# Altium project HP_Power_Cal.PrjPcb
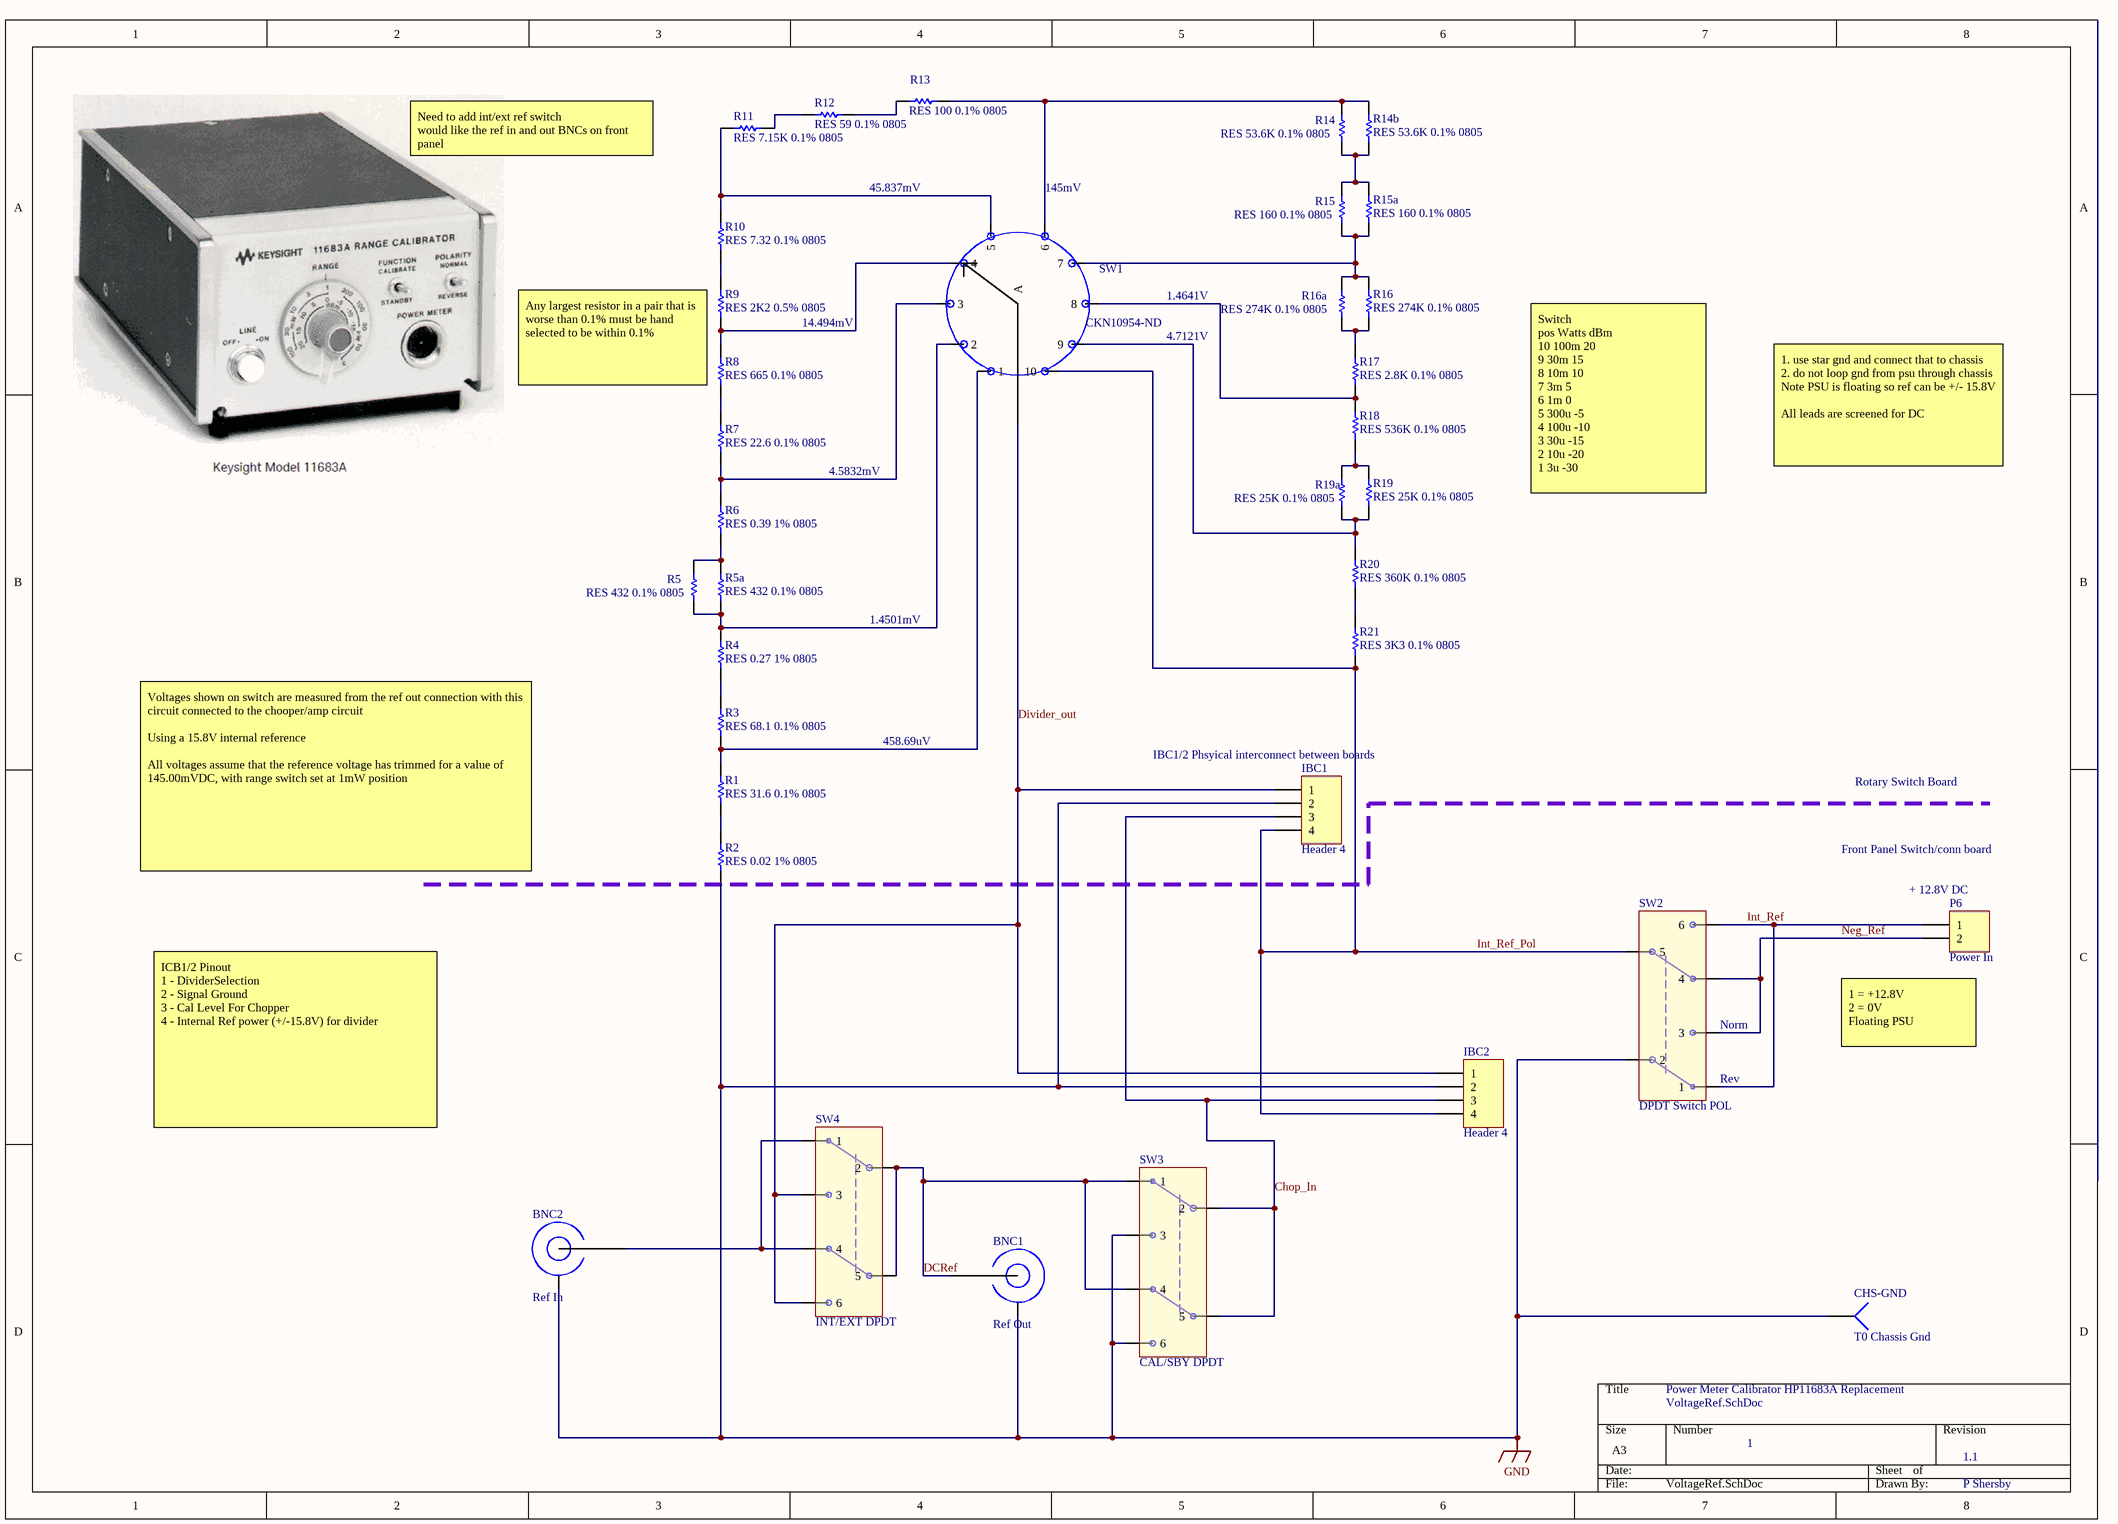
[diagram p0: VoltageRef.SchDoc]
Name: Power Meter Calibrator HP11683A Replacement
3 sheets, 82 parts. Net scope: global (net labels, ports and power ports of the same name join across sheets).
Sheets:
  VoltageRef.SchDoc
  ChopperAmp.SchDoc
  PSU.SchDoc

## Sheet VoltageRef.SchDoc
size A3; Author: P Shersby; SheetNumber: 1

### Parts
BNC1  Ref Out  [BNC PCB Plastic]
BNC2  Ref In  [BNC PCB Plastic]
CHS-GND  T0 Chassis Gnd  [PIN1]
IBC1  Header 4  [HDR1X4]
IBC2  Header 4  [HDR1X4]
P6  Power In  [HDR1X2]
R1  RES 31.6 0.1% 0805  [RESC2013X70X40LL20T20]
R2  RES 0.02 1% 0805  [RESC2013X70X40LL20T20]
R3  RES 68.1 0.1% 0805  [RESC2013X70X40LL20T20]
R4  RES 0.27 1% 0805  [RESC2013X70X40LL20T20]
R5  RES 432 0.1% 0805  [RESC2013X70X40LL20T20]
R5a  RES 432 0.1% 0805  [RESC2013X70X40LL20T20]
R6  RES 0.39 1% 0805  [RESC2013X70X40LL20T20]
R7  RES 22.6 0.1% 0805  [RESC2013X70X40LL20T20]
R8  RES 665 0.1% 0805  [RESC2013X70X40LL20T20]
R9  RES 2K2 0.5% 0805  [RESC2013X70X40LL20T20]
R10  RES 7.32 0.1% 0805  [RESC2013X70X40LL20T20]
R11  RES 7.15K 0.1% 0805  [RESC2013X70X40LL20T20]
R12  RES 59 0.1% 0805  [RESC2013X70X40LL20T20]
R13  RES 100 0.1% 0805  [RESC2013X70X40LL20T20]
R14  RES 53.6K 0.1% 0805  [RESC2013X70X40LL20T20]
R14b  RES 53.6K 0.1% 0805  [RESC2013X70X40LL20T20]
R15  RES 160 0.1% 0805  [RESC2013X70X40LL20T20]
R15a  RES 160 0.1% 0805  [RESC2013X70X40LL20T20]
R16  RES 274K 0.1% 0805  [RESC2013X70X40LL20T20]
R16a  RES 274K 0.1% 0805  [RESC2013X70X40LL20T20]
R17  RES 2.8K 0.1% 0805  [RESC2013X70X40LL20T20]
R18  RES 536K 0.1% 0805  [RESC2013X70X40LL20T20]
R19  RES 25K 0.1% 0805  [RESC2013X70X40LL20T20]
R19a  RES 25K 0.1% 0805  [RESC2013X70X40LL20T20]
R20  RES 360K 0.1% 0805  [RESC2013X70X40LL20T20]
R21  RES 3K3 0.1% 0805  [RESC2013X70X40LL20T20]
SW1  Part Number: CKN10954-ND  [SW_ROT_4x12]  (hidden comment: Rotary Switch 10way)
SW2  DPDT Switch POL  [DPDT Toggle E switch]
SW3  CAL/SBY DPDT  [DPDT Toggle E switch]
SW4  INT/EXT DPDT  [DPDT Toggle E switch]

### Nets
GND: BNC1.2(Gnd) BNC2.2(Gnd) CHS-GND.1 IBC1.2 IBC2.2 R2.1 SW2.2 SW3.3 SW3.6
Chop_In: IBC1.3 IBC2.3 SW3.2 SW3.5
DCRef: BNC1.1(Signal) SW3.1 SW3.4 SW4.2 SW4.5
Divider_out: IBC1.1 IBC2.1 SW1.A SW4.3 SW4.6
Int_Ref: P6.1 SW2.1 SW2.6
Int_Ref_Pol: IBC1.4 IBC2.4 R21.1 SW1.10 SW2.5
Neg_Ref: P6.2 SW2.3 SW2.4
NetBNC2_1: BNC2.1(Signal) SW4.1 SW4.4
NetR1_1: R1.1 R2.2
NetR1_2: R1.2 R3.1 SW1.1
NetR3_2: R3.2 R4.1
NetR4_2: R4.2 R5.1 R5a.1 SW1.2
NetR5_2: R5.2 R5a.2 R6.1
NetR6_2: R6.2 R7.1 SW1.3
NetR7_2: R7.2 R8.1
NetR8_2: R8.2 R9.1 SW1.4
NetR9_2: R9.2 R10.1
NetR10_2: R10.2 R11.1 SW1.5
NetR11_2: R11.2 R12.1
NetR12_2: R12.2 R13.1
NetR13_2: R13.2 R14.2 R14b.2 SW1.6
NetR14_1: R14.1 R14b.1 R15.2 R15a.2
NetR15_1: R15.1 R15a.1 R16.2 R16a.2 SW1.7
NetR16_1: R16.1 R16a.1 R17.2
NetR17_1: R17.1 R18.2 SW1.8
NetR18_1: R18.1 R19.2 R19a.2
NetR19_1: R19.1 R19a.1 R20.2 SW1.9
NetR20_1: R20.1 R21.2

### Notes on the sheet
- Need to add int/ext ref switch
  would like the ref in and out BNCs on front panel
- 45.837mV
- (near SW1) 145mV
- 14.494mV
- 1.4641V
- Any largest resistor in a pair that is worse than 0.1% must be hand selected to be within 0.1%
- 4.7121V
- 1. use star gnd and connect that to chassis
  2. do not loop gnd from psu through chassis
  Note PSU is floating so ref can be +/- 15.8V
  All leads are screened for DC
- 4.5832mV
- Switch
  pos	Watts	dBm
  10	100m	20
  9	30m	15
  8	10m	10
  7	3m	5
  6	1m	0
  5	300u	-5
  4	100u	-10
  3	30u	-15
  2	10u	-20
  1	3u	-30
- 1.4501mV
- 458.69uV
- (near IBC1) IBC1/2 Phsyical interconnect between boards
- Rotary Switch Board
- Voltages shown on switch are measured from the ref out connection with this circuit connected to the chooper/amp circuit
  Using a 15.8V internal reference
  All voltages assume that the reference voltage has trimmed for a value of 145.00mVDC, with range switch set at 1mW position
- Front Panel Switch/conn board
- (near P6) + 12.8V DC
- (near SW2) Norm
- (near P6) 1 = +12.8V
  2 = 0V
  Floating PSU
- ICB1/2 Pinout
  1 - DividerSelection
  2 - Signal Ground
  3 - Cal Level For Chopper
  4 - Internal Ref power (+/-15.8V) for divider
- (near SW2) Rev
- 1.1

### Library data of the parts
BNC1 = BNC PCB: BNC PCB Mount
BNC2 = BNC PCB: BNC Ref Out
CHS-GND = Socket: LatestRevisionDate: 17-Jul-2002; LatestRevisionNote: Re-released for DXP Platform.; Publisher: Altium Limited
IBC1 IBC2 = Header 4: Header, 4-Pin; LatestRevisionDate: 17-Jul-2002; LatestRevisionNote: Re-released for DXP Platform.; Publisher: Altium Limited
P6 = Header 2: Header, 2-Pin; LatestRevisionDate: 17-Jul-2002; LatestRevisionNote: Re-released for DXP Platform.; Publisher: Altium Limited
R1 = CMP-2001-00110-5: Resistor 31.6 0.1% 0805  0.2W 10ppm/C; Manufacturer: Panasonic; Voltage Rating: 150 V; Package Quantity: 5000; PackageDescription: 2-Pin Surface Mount Device, Body 2 x 1.25 mm; Mounting Technology: Surface Mount; ComponentLink2URL: http://industrial.panasonic.com/cdbs/www-data/pdf/RDA0000/AOA0000C86.pdf; DatasheetVersion: 04/2015; ComponentLink1URL: http://www.panasonic.com/; Mount: Surface Mount; ComponentLink1Description: Manufacturer URL; RoHSCompliant: true; PackageReference: 0805; Min Operating Temperature: -55 degC; Height: 0.6 mm; ComponentLink2Description: Datasheet; Max Operating Temperature: 155 degC; Length: 2 mm; Packaging: Tape and Reel; REACH SVHC: Yes
R2 = CMP-2001-00110-5: Resistor 0.02 1% 0805  0.5W 50ppm/C; Manufacturer: Panasonic; Voltage Rating: 150 V; Package Quantity: 5000; PackageDescription: 2-Pin Surface Mount Device, Body 2 x 1.25 mm; Mounting Technology: Surface Mount; ComponentLink2URL: http://industrial.panasonic.com/cdbs/www-data/pdf/RDA0000/AOA0000C86.pdf; DatasheetVersion: 04/2015; ComponentLink1URL: http://www.panasonic.com/; Mount: Surface Mount; ComponentLink1Description: Manufacturer URL; RoHSCompliant: true; PackageReference: 0805; Min Operating Temperature: -55 degC; Height: 0.6 mm; ComponentLink2Description: Datasheet; Max Operating Temperature: 155 degC; Length: 2 mm; Packaging: Tape and Reel; REACH SVHC: Yes
R3 = CMP-2001-00110-5: Resistor 68.1 0.1% 0805  0.2W 10ppm/C; Manufacturer: Panasonic; Voltage Rating: 150 V; Package Quantity: 5000; PackageDescription: 2-Pin Surface Mount Device, Body 2 x 1.25 mm; Mounting Technology: Surface Mount; ComponentLink2URL: http://industrial.panasonic.com/cdbs/www-data/pdf/RDA0000/AOA0000C86.pdf; DatasheetVersion: 04/2015; ComponentLink1URL: http://www.panasonic.com/; Mount: Surface Mount; ComponentLink1Description: Manufacturer URL; RoHSCompliant: true; PackageReference: 0805; Min Operating Temperature: -55 degC; Height: 0.6 mm; ComponentLink2Description: Datasheet; Max Operating Temperature: 155 degC; Length: 2 mm; Packaging: Tape and Reel; REACH SVHC: Yes
R4 = CMP-2001-00110-5: Resistor 0.27 1% 0805  0.2W 10ppm/C; Manufacturer: Panasonic; Voltage Rating: 150 V; Package Quantity: 5000; PackageDescription: 2-Pin Surface Mount Device, Body 2 x 1.25 mm; Mounting Technology: Surface Mount; ComponentLink2URL: http://industrial.panasonic.com/cdbs/www-data/pdf/RDA0000/AOA0000C86.pdf; DatasheetVersion: 04/2015; ComponentLink1URL: http://www.panasonic.com/; Mount: Surface Mount; ComponentLink1Description: Manufacturer URL; RoHSCompliant: true; PackageReference: 0805; Min Operating Temperature: -55 degC; Height: 0.6 mm; ComponentLink2Description: Datasheet; Max Operating Temperature: 155 degC; Length: 2 mm; Packaging: Tape and Reel; REACH SVHC: Yes
R5 R5a = CMP-2001-00110-5: Resistor 432 0.1% 0805  0.2W 10ppm/C; Manufacturer: Panasonic; Voltage Rating: 150 V; Package Quantity: 5000; PackageDescription: 2-Pin Surface Mount Device, Body 2 x 1.25 mm; Mounting Technology: Surface Mount; ComponentLink2URL: http://industrial.panasonic.com/cdbs/www-data/pdf/RDA0000/AOA0000C86.pdf; DatasheetVersion: 04/2015; ComponentLink1URL: http://www.panasonic.com/; Mount: Surface Mount; ComponentLink1Description: Manufacturer URL; RoHSCompliant: true; PackageReference: 0805; Min Operating Temperature: -55 degC; Height: 0.6 mm; ComponentLink2Description: Datasheet; Max Operating Temperature: 155 degC; Length: 2 mm; Packaging: Tape and Reel; REACH SVHC: Yes
R6 = CMP-2001-00110-5: Resistor 0.39 1% 0805  0.2W 10ppm/C; Manufacturer: Panasonic; Voltage Rating: 150 V; Package Quantity: 5000; PackageDescription: 2-Pin Surface Mount Device, Body 2 x 1.25 mm; Mounting Technology: Surface Mount; ComponentLink2URL: http://industrial.panasonic.com/cdbs/www-data/pdf/RDA0000/AOA0000C86.pdf; DatasheetVersion: 04/2015; ComponentLink1URL: http://www.panasonic.com/; Mount: Surface Mount; ComponentLink1Description: Manufacturer URL; RoHSCompliant: true; PackageReference: 0805; Min Operating Temperature: -55 degC; Height: 0.6 mm; ComponentLink2Description: Datasheet; Max Operating Temperature: 155 degC; Length: 2 mm; Packaging: Tape and Reel; REACH SVHC: Yes
R7 = CMP-2001-00110-5: Resistor 22.6 0.1% 0805  0.2W 10ppm/C; Manufacturer: Panasonic; Voltage Rating: 150 V; Package Quantity: 5000; PackageDescription: 2-Pin Surface Mount Device, Body 2 x 1.25 mm; Mounting Technology: Surface Mount; ComponentLink2URL: http://industrial.panasonic.com/cdbs/www-data/pdf/RDA0000/AOA0000C86.pdf; DatasheetVersion: 04/2015; ComponentLink1URL: http://www.panasonic.com/; Mount: Surface Mount; ComponentLink1Description: Manufacturer URL; RoHSCompliant: true; PackageReference: 0805; Min Operating Temperature: -55 degC; Height: 0.6 mm; ComponentLink2Description: Datasheet; Max Operating Temperature: 155 degC; Length: 2 mm; Packaging: Tape and Reel; REACH SVHC: Yes
R8 = CMP-2001-00110-5: Resistor 665 0.1% 0805  0.2W 10ppm/C; Manufacturer: Panasonic; Voltage Rating: 150 V; Package Quantity: 5000; PackageDescription: 2-Pin Surface Mount Device, Body 2 x 1.25 mm; Mounting Technology: Surface Mount; ComponentLink2URL: http://industrial.panasonic.com/cdbs/www-data/pdf/RDA0000/AOA0000C86.pdf; DatasheetVersion: 04/2015; ComponentLink1URL: http://www.panasonic.com/; Mount: Surface Mount; ComponentLink1Description: Manufacturer URL; RoHSCompliant: true; PackageReference: 0805; Min Operating Temperature: -55 degC; Height: 0.6 mm; ComponentLink2Description: Datasheet; Max Operating Temperature: 155 degC; Length: 2 mm; Packaging: Tape and Reel; REACH SVHC: Yes
R9 = CMP-2001-00110-5: Resistor 2K2 0.5%  0805  0.2W 10ppm/C; Manufacturer: Panasonic; Voltage Rating: 150 V; Package Quantity: 5000; PackageDescription: 2-Pin Surface Mount Device, Body 2 x 1.25 mm; Mounting Technology: Surface Mount; ComponentLink2URL: http://industrial.panasonic.com/cdbs/www-data/pdf/RDA0000/AOA0000C86.pdf; DatasheetVersion: 04/2015; ComponentLink1URL: http://www.panasonic.com/; Mount: Surface Mount; ComponentLink1Description: Manufacturer URL; RoHSCompliant: true; PackageReference: 0805; Min Operating Temperature: -55 degC; Height: 0.6 mm; ComponentLink2Description: Datasheet; Max Operating Temperature: 155 degC; Length: 2 mm; Packaging: Tape and Reel; REACH SVHC: Yes
R10 = CMP-2001-00110-5: Resistor 7.32 0.1% 0805  0.2W 10ppm/C; Manufacturer: Panasonic; Voltage Rating: 150 V; Package Quantity: 5000; PackageDescription: 2-Pin Surface Mount Device, Body 2 x 1.25 mm; Mounting Technology: Surface Mount; ComponentLink2URL: http://industrial.panasonic.com/cdbs/www-data/pdf/RDA0000/AOA0000C86.pdf; DatasheetVersion: 04/2015; ComponentLink1URL: http://www.panasonic.com/; Mount: Surface Mount; ComponentLink1Description: Manufacturer URL; RoHSCompliant: true; PackageReference: 0805; Min Operating Temperature: -55 degC; Height: 0.6 mm; ComponentLink2Description: Datasheet; Max Operating Temperature: 155 degC; Length: 2 mm; Packaging: Tape and Reel; REACH SVHC: Yes
R11 = CMP-2001-00110-5: Resistor 7.15K 0.1% 0805  0.2W 10ppm/C; Manufacturer: Panasonic; Voltage Rating: 150 V; Package Quantity: 5000; PackageDescription: 2-Pin Surface Mount Device, Body 2 x 1.25 mm; Mounting Technology: Surface Mount; ComponentLink2URL: http://industrial.panasonic.com/cdbs/www-data/pdf/RDA0000/AOA0000C86.pdf; DatasheetVersion: 04/2015; ComponentLink1URL: http://www.panasonic.com/; Mount: Surface Mount; ComponentLink1Description: Manufacturer URL; RoHSCompliant: true; PackageReference: 0805; Min Operating Temperature: -55 degC; Height: 0.6 mm; ComponentLink2Description: Datasheet; Max Operating Temperature: 155 degC; Length: 2 mm; Packaging: Tape and Reel; REACH SVHC: Yes
R12 = CMP-2001-00110-5: Resistor 59 0.1% 0805  0.2W 10ppm/C; Manufacturer: Panasonic; Voltage Rating: 150 V; Package Quantity: 5000; PackageDescription: 2-Pin Surface Mount Device, Body 2 x 1.25 mm; Mounting Technology: Surface Mount; ComponentLink2URL: http://industrial.panasonic.com/cdbs/www-data/pdf/RDA0000/AOA0000C86.pdf; DatasheetVersion: 04/2015; ComponentLink1URL: http://www.panasonic.com/; Mount: Surface Mount; ComponentLink1Description: Manufacturer URL; RoHSCompliant: true; PackageReference: 0805; Min Operating Temperature: -55 degC; Height: 0.6 mm; ComponentLink2Description: Datasheet; Max Operating Temperature: 155 degC; Length: 2 mm; Packaging: Tape and Reel; REACH SVHC: Yes
R13 = CMP-2001-00110-5: Resistor 100 0.1% 0805  0.2W 10ppm/C; Manufacturer: Panasonic; Voltage Rating: 150 V; Package Quantity: 5000; PackageDescription: 2-Pin Surface Mount Device, Body 2 x 1.25 mm; Mounting Technology: Surface Mount; ComponentLink2URL: http://industrial.panasonic.com/cdbs/www-data/pdf/RDA0000/AOA0000C86.pdf; DatasheetVersion: 04/2015; ComponentLink1URL: http://www.panasonic.com/; Mount: Surface Mount; ComponentLink1Description: Manufacturer URL; RoHSCompliant: true; PackageReference: 0805; Min Operating Temperature: -55 degC; Height: 0.6 mm; ComponentLink2Description: Datasheet; Max Operating Temperature: 155 degC; Length: 2 mm; Packaging: Tape and Reel; REACH SVHC: Yes
R14 R14b = CMP-2001-00110-5: Resistor 53.6K 0.1% 0805  0.2W 10ppm/C; Manufacturer: Panasonic; Voltage Rating: 150 V; Package Quantity: 5000; PackageDescription: 2-Pin Surface Mount Device, Body 2 x 1.25 mm; Mounting Technology: Surface Mount; ComponentLink2URL: http://industrial.panasonic.com/cdbs/www-data/pdf/RDA0000/AOA0000C86.pdf; DatasheetVersion: 04/2015; ComponentLink1URL: http://www.panasonic.com/; Mount: Surface Mount; ComponentLink1Description: Manufacturer URL; RoHSCompliant: true; PackageReference: 0805; Min Operating Temperature: -55 degC; Height: 0.6 mm; ComponentLink2Description: Datasheet; Max Operating Temperature: 155 degC; Length: 2 mm; Packaging: Tape and Reel; REACH SVHC: Yes
R15 R15a = CMP-2001-00110-5: Resistor 160 0.1% 0805  0.2W 10ppm/C; Manufacturer: Panasonic; Voltage Rating: 150 V; Package Quantity: 5000; PackageDescription: 2-Pin Surface Mount Device, Body 2 x 1.25 mm; Mounting Technology: Surface Mount; ComponentLink2URL: http://industrial.panasonic.com/cdbs/www-data/pdf/RDA0000/AOA0000C86.pdf; DatasheetVersion: 04/2015; ComponentLink1URL: http://www.panasonic.com/; Mount: Surface Mount; ComponentLink1Description: Manufacturer URL; RoHSCompliant: true; PackageReference: 0805; Min Operating Temperature: -55 degC; Height: 0.6 mm; ComponentLink2Description: Datasheet; Max Operating Temperature: 155 degC; Length: 2 mm; Packaging: Tape and Reel; REACH SVHC: Yes
R16 R16a = CMP-2001-00110-5: Resistor 274K 0.1% 0805  0.2W 10ppm/C; Manufacturer: Panasonic; Voltage Rating: 150 V; Package Quantity: 5000; PackageDescription: 2-Pin Surface Mount Device, Body 2 x 1.25 mm; Mounting Technology: Surface Mount; ComponentLink2URL: http://industrial.panasonic.com/cdbs/www-data/pdf/RDA0000/AOA0000C86.pdf; DatasheetVersion: 04/2015; ComponentLink1URL: http://www.panasonic.com/; Mount: Surface Mount; ComponentLink1Description: Manufacturer URL; RoHSCompliant: true; PackageReference: 0805; Min Operating Temperature: -55 degC; Height: 0.6 mm; ComponentLink2Description: Datasheet; Max Operating Temperature: 155 degC; Length: 2 mm; Packaging: Tape and Reel; REACH SVHC: Yes
R17 = CMP-2001-00110-5: Resistor 2.8K 0.1% 0805  0.2W 10ppm/C; Manufacturer: Panasonic; Voltage Rating: 150 V; Package Quantity: 5000; PackageDescription: 2-Pin Surface Mount Device, Body 2 x 1.25 mm; Mounting Technology: Surface Mount; ComponentLink2URL: http://industrial.panasonic.com/cdbs/www-data/pdf/RDA0000/AOA0000C86.pdf; DatasheetVersion: 04/2015; ComponentLink1URL: http://www.panasonic.com/; Mount: Surface Mount; ComponentLink1Description: Manufacturer URL; RoHSCompliant: true; PackageReference: 0805; Min Operating Temperature: -55 degC; Height: 0.6 mm; ComponentLink2Description: Datasheet; Max Operating Temperature: 155 degC; Length: 2 mm; Packaging: Tape and Reel; REACH SVHC: Yes
R18 = CMP-2001-00110-5: Resistor 536K 0.1% 0805  1/8W 10ppm/C; Manufacturer: Panasonic; Voltage Rating: 150 V; Package Quantity: 5000; PackageDescription: 2-Pin Surface Mount Device, Body 2 x 1.25 mm; Mounting Technology: Surface Mount; ComponentLink2URL: http://industrial.panasonic.com/cdbs/www-data/pdf/RDA0000/AOA0000C86.pdf; DatasheetVersion: 04/2015; ComponentLink1URL: http://www.panasonic.com/; Mount: Surface Mount; ComponentLink1Description: Manufacturer URL; RoHSCompliant: true; PackageReference: 0805; Min Operating Temperature: -55 degC; Height: 0.6 mm; ComponentLink2Description: Datasheet; Max Operating Temperature: 155 degC; Length: 2 mm; Packaging: Tape and Reel; REACH SVHC: Yes
R19 R19a = CMP-2001-00110-5: Resistor 25K 0.1% 0805  0.1W 10ppm/C; Manufacturer: Panasonic; Voltage Rating: 150 V; Package Quantity: 5000; PackageDescription: 2-Pin Surface Mount Device, Body 2 x 1.25 mm; Mounting Technology: Surface Mount; ComponentLink2URL: http://industrial.panasonic.com/cdbs/www-data/pdf/RDA0000/AOA0000C86.pdf; DatasheetVersion: 04/2015; ComponentLink1URL: http://www.panasonic.com/; Mount: Surface Mount; ComponentLink1Description: Manufacturer URL; RoHSCompliant: true; PackageReference: 0805; Min Operating Temperature: -55 degC; Height: 0.6 mm; ComponentLink2Description: Datasheet; Max Operating Temperature: 155 degC; Length: 2 mm; Packaging: Tape and Reel; REACH SVHC: Yes
R20 = CMP-2001-00110-5: Resistor 360K 0.1% 0805  1/8W 10ppm/C; Manufacturer: Panasonic; Voltage Rating: 150 V; Package Quantity: 5000; PackageDescription: 2-Pin Surface Mount Device, Body 2 x 1.25 mm; Mounting Technology: Surface Mount; ComponentLink2URL: http://industrial.panasonic.com/cdbs/www-data/pdf/RDA0000/AOA0000C86.pdf; DatasheetVersion: 04/2015; ComponentLink1URL: http://www.panasonic.com/; Mount: Surface Mount; ComponentLink1Description: Manufacturer URL; RoHSCompliant: true; PackageReference: 0805; Min Operating Temperature: -55 degC; Height: 0.6 mm; ComponentLink2Description: Datasheet; Max Operating Temperature: 155 degC; Length: 2 mm; Packaging: Tape and Reel; REACH SVHC: Yes
R21 = CMP-2001-00110-5: Resistor 3K3 0.1% 0805  0.2W 10ppm/C; Manufacturer: Panasonic; Voltage Rating: 150 V; Package Quantity: 5000; PackageDescription: 2-Pin Surface Mount Device, Body 2 x 1.25 mm; Mounting Technology: Surface Mount; ComponentLink2URL: http://industrial.panasonic.com/cdbs/www-data/pdf/RDA0000/AOA0000C86.pdf; DatasheetVersion: 04/2015; ComponentLink1URL: http://www.panasonic.com/; Mount: Surface Mount; ComponentLink1Description: Manufacturer URL; RoHSCompliant: true; PackageReference: 0805; Min Operating Temperature: -55 degC; Height: 0.6 mm; ComponentLink2Description: Datasheet; Max Operating Temperature: 155 degC; Length: 2 mm; Packaging: Tape and Reel; REACH SVHC: Yes
SW1 = Rotary_Switch_1x10: Rotary Switch 10way PCB CKN10954-ND
SW2 SW4 = DPDT Switch
SW3 = DPDT Switch: CAL/SDBY DPDT

## Sheet ChopperAmp.SchDoc
size A3; Author: P Shersby; SheetNumber: 1; SheetTotal: 1; DocumentName: Sampling Gate Assembly
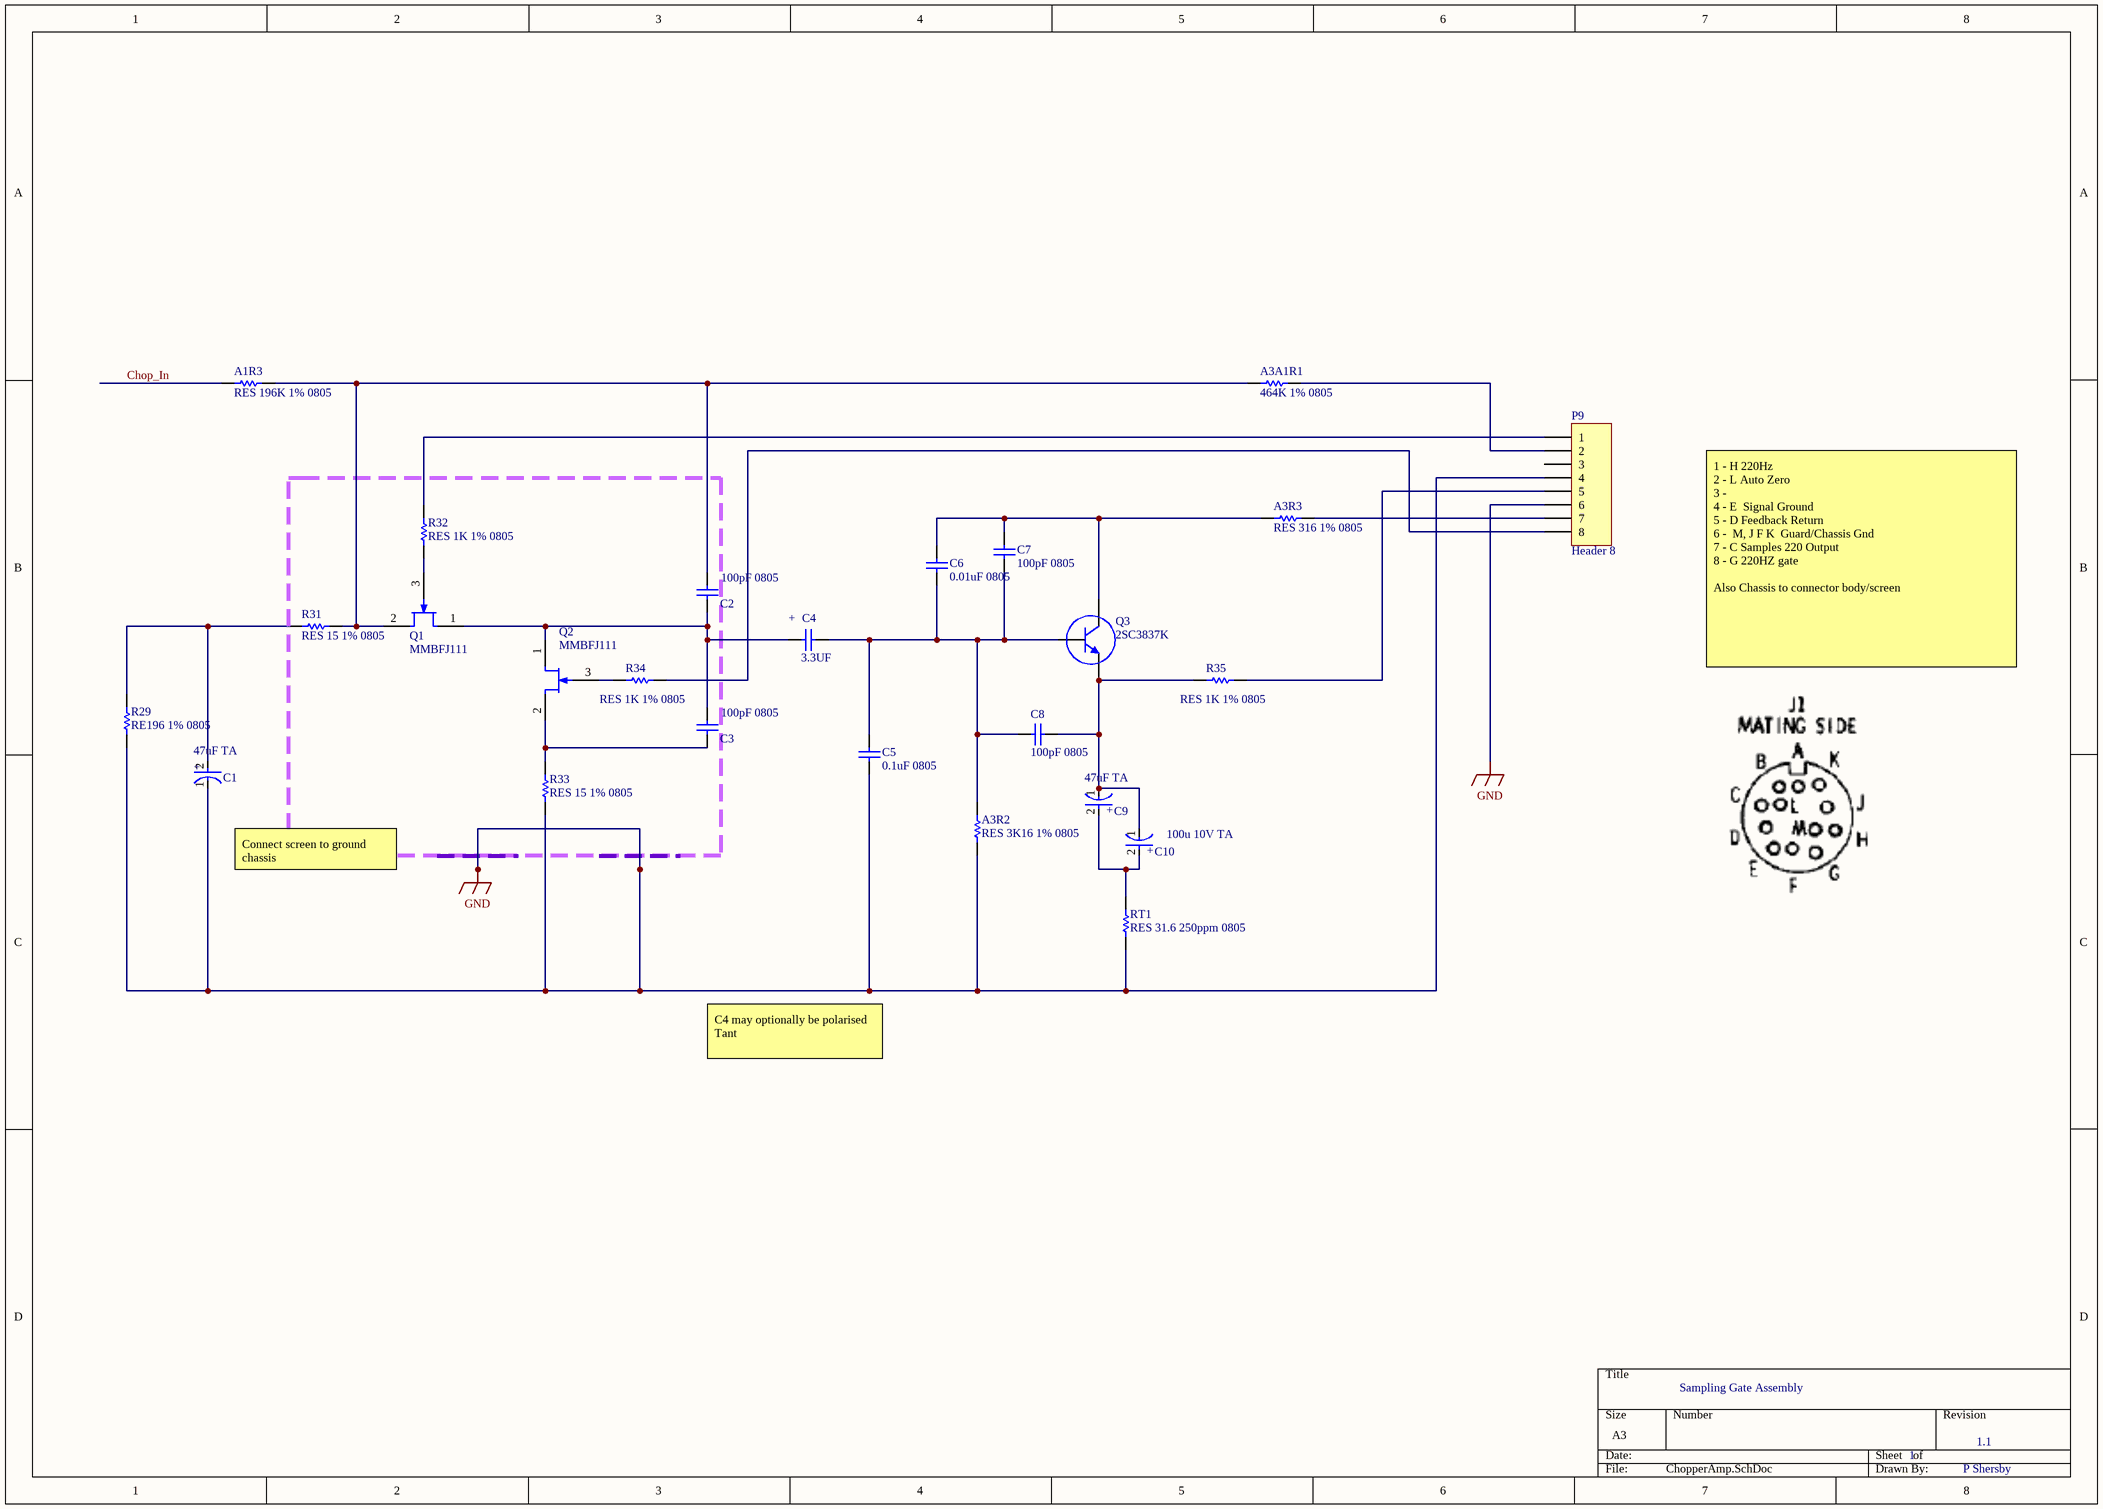
[diagram p1: ChopperAmp.SchDoc]

### Parts
A1R3  RES 196K 1% 0805  [RESC2013X70X40LL20T20]
A3A1R1  464K 1% 0805  [RESC2013X70X40LL20T20]
A3R2  RES 3K16 1% 0805  [RESC2013X70X40LL20T20]
A3R3  RES 316 1% 0805  [RESC2013X70X40LL20T20]
C1  47uF TA  [FP-TAJB-MFG]
C2  100pF 0805  [CAPC2113X88X50NL30T25]
C3  100pF 0805  [CAPC2113X88X50NL30T25]
C4  3.3UF  [CAPC1206(3216)150_L]
C5  0.1uF 0805  [CAPC2113X88X50NL30T25]
C6  0.01uF 0805  [CAPC2113X88X50NL30T25]
C7  100pF 0805  [CAPC2113X88X50NL30T25]
C8  100pF 0805  [CAPC2113X88X50NL30T25]
C9  47uF TA  [FP-TAJB-MFG]
C10  100u 10V TA  [FP-TPE-D4-MFG]
P9  Header 8  [HDR1X8]
Q1  MMBFJ111  [ONSC-SOT-23-3-318-08_V]
Q2  MMBFJ111  [ONSC-SOT-23-3-318-08_V]
Q3  2SC3837K  [SC-59]
R29  RE196 1% 0805  [RESC2013X70X40LL20T20]
R31  RES 15 1% 0805  [RESC2013X70X40LL20T20]
R32  RES 1K 1% 0805  [RESC2013X70X40LL20T20]
R33  RES 15 1% 0805  [RESC2013X70X40LL20T20]
R34  RES 1K 1% 0805  [RESC2013X70X40LL20T20]
R35  RES 1K 1% 0805  [RESC2013X70X40LL20T20]
RT1  RES 31.6 250ppm 0805  [RESC2013X70X40LL20T20]
SC1  ScreenConnection  [ScreenConnection]  (value not drawn)
SC2  ScreenConnection  [ScreenConnection]  (value not drawn)

### Nets
GND: A3R2.1 C1.1(C) C5.2 P9.4 P9.6 R29.2 R33.2 RT1.1 SC1.1 SC2.1
Chop_In: A1R3.1
NetA1R3_2: A1R3.2 A3A1R1.1 C2.2 Q1.2(S) R31.1
NetA3A1R1_2: A3A1R1.2 P9.2
NetA3R2_2: A3R2.2 C4.2 C5.1 C6.2 C7.2 C8.2 Q3.2(B)
NetA3R3_1: A3R3.1 C6.1 C7.1 Q3.1(C)
NetA3R3_2: A3R3.2 P9.7
NetC1_2: C1.2(A) R29.1 R31.2
NetC2_1: C2.1 C3.2 C4.1 Q1.1(D) Q2.1(D)
NetC3_1: C3.1 Q2.2(S) R33.1
NetC8_1: C8.1 C9.1(C) C10.1(C) Q3.3(E) R35.1
NetC9_2: C9.2(A) C10.2(A) RT1.2
NetP9_1: P9.1 R32.1
NetP9_5: P9.5 R35.2
NetP9_8: P9.8 R34.2
NetQ1_3: Q1.3(G) R32.2
NetQ2_3: Q2.3(G) R34.1

Not connected (* = marked no-connect by the designer): P9 3

### Notes on the sheet
- (near C4) +
- 1 - H 220Hz
  2 - L Auto Zero
  3 -
  4 - E  Signal Ground
  5 - D Feedback Return
  6 -  M, J F K  Guard/Chassis Gnd
  7 - C Samples 220 Output
  8 - G 220HZ gate
  Also Chassis to connector body/screen
- Connect screen to ground chassis
- C4 may optionally be polarised Tant
- 1.1
- (in symbol CMP-04424-000035-1) +
- (in symbol CMP-05428-000010-1) +

### Library data of the parts
A1R3 = CMP-2001-00110-5: Resistor 196K 1% 0805  1/8W 10ppm/C; Manufacturer: Panasonic; Voltage Rating: 150 V; Package Quantity: 5000; PackageDescription: 2-Pin Surface Mount Device, Body 2 x 1.25 mm; Mounting Technology: Surface Mount; ComponentLink2URL: http://industrial.panasonic.com/cdbs/www-data/pdf/RDA0000/AOA0000C86.pdf; DatasheetVersion: 04/2015; ComponentLink1URL: http://www.panasonic.com/; Mount: Surface Mount; ComponentLink1Description: Manufacturer URL; RoHSCompliant: true; PackageReference: 0805; Min Operating Temperature: -55 degC; Height: 0.6 mm; ComponentLink2Description: Datasheet; Max Operating Temperature: 155 degC; Length: 2 mm; Packaging: Tape and Reel; REACH SVHC: Yes
A3A1R1 = CMP-2001-00110-5: Resistor 464K 1% 0805   0.2W 10ppm/C; Manufacturer: Panasonic; Voltage Rating: 150 V; Package Quantity: 5000; PackageDescription: 2-Pin Surface Mount Device, Body 2 x 1.25 mm; Mounting Technology: Surface Mount; ComponentLink2URL: http://industrial.panasonic.com/cdbs/www-data/pdf/RDA0000/AOA0000C86.pdf; DatasheetVersion: 04/2015; ComponentLink1URL: http://www.panasonic.com/; Mount: Surface Mount; ComponentLink1Description: Manufacturer URL; RoHSCompliant: true; PackageReference: 0805; Min Operating Temperature: -55 degC; Height: 0.6 mm; ComponentLink2Description: Datasheet; Max Operating Temperature: 155 degC; Length: 2 mm; Packaging: Tape and Reel; REACH SVHC: Yes
A3R2 = CMP-2001-00110-5: Resistor 3K!6 1% 0805  1/8W 10ppm/C; Manufacturer: Panasonic; Voltage Rating: 150 V; Package Quantity: 5000; PackageDescription: 2-Pin Surface Mount Device, Body 2 x 1.25 mm; Mounting Technology: Surface Mount; ComponentLink2URL: http://industrial.panasonic.com/cdbs/www-data/pdf/RDA0000/AOA0000C86.pdf; DatasheetVersion: 04/2015; ComponentLink1URL: http://www.panasonic.com/; Mount: Surface Mount; ComponentLink1Description: Manufacturer URL; RoHSCompliant: true; PackageReference: 0805; Min Operating Temperature: -55 degC; Height: 0.6 mm; ComponentLink2Description: Datasheet; Max Operating Temperature: 155 degC; Length: 2 mm; Packaging: Tape and Reel; REACH SVHC: Yes
A3R3 = CMP-2001-00110-5: Resistor 316 1% 0805  1/8W 10ppm/C; Manufacturer: Panasonic; Voltage Rating: 150 V; Package Quantity: 5000; PackageDescription: 2-Pin Surface Mount Device, Body 2 x 1.25 mm; Mounting Technology: Surface Mount; ComponentLink2URL: http://industrial.panasonic.com/cdbs/www-data/pdf/RDA0000/AOA0000C86.pdf; DatasheetVersion: 04/2015; ComponentLink1URL: http://www.panasonic.com/; Mount: Surface Mount; ComponentLink1Description: Manufacturer URL; RoHSCompliant: true; PackageReference: 0805; Min Operating Temperature: -55 degC; Height: 0.6 mm; ComponentLink2Description: Datasheet; Max Operating Temperature: 155 degC; Length: 2 mm; Packaging: Tape and Reel; REACH SVHC: Yes
C1 C9 = CMP-04424-000035-1: 47uF Tant 4V 1411; Manufacturer: AVX Corporation; Manufacturer Part Number: TAJB475K010RNJ; Life: 1000Hours; Material: Tantalum; Ripple Current: 146mA; Value: 4.7uF; Esr: 4Ω; Voltage Rating: 10V; Dissipation Factor: 6%; Tolerance: 10%; Footprint Url: https://www.avx.com/docs/techinfo/TechSumAppGuide.pdf; Category: Cap; Device Class L1: Passive Components; ComponentLink2URL: http://datasheets.avx.com/TAJ.pdf; Height: 2.1mm; RoHS: TRUE; Automotive: No; Temperature: -55°C to +125°C; Lead Free: Yes; Digikey Description: CAP TANT 4.7UF 10% 10V 1411; Package: TAJB; Device Class L2: Capacitors; Mouser Description: Cap Tant Solid 4.7uF 10V B CASE 10% (3.5 X 2.8 X 1.9mm) SMD 3528-21 4 Ohm 125 C T/R; ComponentLink2Description: Datasheet; Device Class L3: Tantalum Capacitors; Temperature Range High: +125°C; Temperature Range Low: -55°C; Octopart: https://octopart.com/tajb475k010rnj-avx-2636133; Capacitance: 4.7uF
C2 C3 C5-C8 = CMP-2007-00001-1: Manufacturer: Kemet; Part Number: C0805X474K4RACTU
C4 = CMP-1590-00001-1: 1206 (3216 Metric) Chip Capacitor; Case-Metric: 3216; Case-EIA: 1206; PackageReference: CAPC1206(3216)150
C10 = CMP-05428-000010-1: CAP TANT 100u 10V; Manufacturer Part Number: 6TPE330MAA; Manufacturer: Panasonic Electronic; Tolerance: 20%; Value: 330uF; Ripple Current: 4400mA; Voltage Rating: 6.3V; Life: 1000Hours; Leakage Current: 207.9uA; Esr: 10mΩ; Material: Polymer; Dissipation Factor: 10%; Temperature Range High: +105°C; Mouser Description: Tantalum Capacitors - Polymer SMD 6.3volts 330uF ESR 10mohm; Device Class L3: Polymer Capacitors; ComponentLink2URL: https://industrial.panasonic.com/cdbs/www-data/pdf/AAA8000/AAA8000C36.pdf; Digikey Description: CAP TANT POLY 330UF 6.3V 2917; Temperature: -55°C to +105°C; Category: Cap; Package: TPE-D4; Temperature Range Low: -55°C; Footprint Url: https://industrial.panasonic.com/cdbs/www-data/pdf/AAA8000/AAA8000COL85.pdf; Height: 4mm; Octopart: https://octopart.com/6tpe330maa-panasonic-29487875; ComponentLink2Description: Datasheet; Device Class L1: Passive Components; Device Class L2: Capacitors; Lead Free: Yes; RoHS: TRUE; Automotive: No; Capacitance: 330uF
P9 = Header 8: Header, 8-Pin; LatestRevisionDate: 17-Jul-2002; LatestRevisionNote: Re-released for DXP Platform.; Publisher: Altium Limited
Q1 Q2 = CMP-1062-00038-1: JFET - VHF / UJFET Chopper; PartNumber: MMBFJ310LT3; Manufacturer: On Semiconductor; IDSS Min (uA): 24000; Crss Max (pF): 2.5; Ciss Max (pF): 5; Channel Polarity: N Channel; V(BR)GSS Min (V): 25; Packing: Tape and Reel; IDSS Max (uA): 60000; ComponentLink1URL: http://www.onsemi.com/; PackageReference: SOT-23-3-318-08; ComponentLink3URL: http://www.onsemi.cn/pub_link/Collateral/318-08.PDF; PackageDescription: 3-Pin Small Outline Transistor, Body 2.92 x 1.3 mm, Pitch 0.95 mm; DatasheetVersion: Rev. 7; ComponentLink2URL: http://www.onsemi.cn/pub_link/Collateral/MMBFJ309LT1-D.PDF; ComponentLink2Description: Datasheet; PackageVersion: Rev. AP, 11/2009; ComponentLink1Description: Manufacturer URL; ComponentLink3Description: Package Specification; Mounting Technology: Surface Mount
Q3 = NPN: pin to pad: 1>3 3>1
R29 = CMP-2001-00110-5: Resistor 196 1% 0805  0.2W 10ppm/C; Manufacturer: Panasonic; Voltage Rating: 150 V; Package Quantity: 5000; PackageDescription: 2-Pin Surface Mount Device, Body 2 x 1.25 mm; Mounting Technology: Surface Mount; ComponentLink2URL: http://industrial.panasonic.com/cdbs/www-data/pdf/RDA0000/AOA0000C86.pdf; DatasheetVersion: 04/2015; ComponentLink1URL: http://www.panasonic.com/; Mount: Surface Mount; ComponentLink1Description: Manufacturer URL; RoHSCompliant: true; PackageReference: 0805; Min Operating Temperature: -55 degC; Height: 0.6 mm; ComponentLink2Description: Datasheet; Max Operating Temperature: 155 degC; Length: 2 mm; Packaging: Tape and Reel; REACH SVHC: Yes
R31 R33 = CMP-2001-00110-5: Resistor 15 1% 0805  0.2W 10ppm/C; Manufacturer: Panasonic; Voltage Rating: 150 V; Package Quantity: 5000; PackageDescription: 2-Pin Surface Mount Device, Body 2 x 1.25 mm; Mounting Technology: Surface Mount; ComponentLink2URL: http://industrial.panasonic.com/cdbs/www-data/pdf/RDA0000/AOA0000C86.pdf; DatasheetVersion: 04/2015; ComponentLink1URL: http://www.panasonic.com/; Mount: Surface Mount; ComponentLink1Description: Manufacturer URL; RoHSCompliant: true; PackageReference: 0805; Min Operating Temperature: -55 degC; Height: 0.6 mm; ComponentLink2Description: Datasheet; Max Operating Temperature: 155 degC; Length: 2 mm; Packaging: Tape and Reel; REACH SVHC: Yes
R32 = CMP-2001-00110-5: Resistor 1K 1% 0805  0.2W 10ppm/C; Manufacturer: Panasonic; Voltage Rating: 150 V; Package Quantity: 5000; PackageDescription: 2-Pin Surface Mount Device, Body 2 x 1.25 mm; Mounting Technology: Surface Mount; ComponentLink2URL: http://industrial.panasonic.com/cdbs/www-data/pdf/RDA0000/AOA0000C86.pdf; DatasheetVersion: 04/2015; ComponentLink1URL: http://www.panasonic.com/; Mount: Surface Mount; ComponentLink1Description: Manufacturer URL; RoHSCompliant: true; PackageReference: 0805; Min Operating Temperature: -55 degC; Height: 0.6 mm; ComponentLink2Description: Datasheet; Max Operating Temperature: 155 degC; Length: 2 mm; Packaging: Tape and Reel; REACH SVHC: Yes
R34 R35 = CMP-2001-00110-5: Resistor 1K1% 0805  0.2W 10ppm/C; Manufacturer: Panasonic; Voltage Rating: 150 V; Package Quantity: 5000; PackageDescription: 2-Pin Surface Mount Device, Body 2 x 1.25 mm; Mounting Technology: Surface Mount; ComponentLink2URL: http://industrial.panasonic.com/cdbs/www-data/pdf/RDA0000/AOA0000C86.pdf; DatasheetVersion: 04/2015; ComponentLink1URL: http://www.panasonic.com/; Mount: Surface Mount; ComponentLink1Description: Manufacturer URL; RoHSCompliant: true; PackageReference: 0805; Min Operating Temperature: -55 degC; Height: 0.6 mm; ComponentLink2Description: Datasheet; Max Operating Temperature: 155 degC; Length: 2 mm; Packaging: Tape and Reel; REACH SVHC: Yes
RT1 = CMP-2001-00110-5: Manufacturer: Panasonic; Voltage Rating: 150 V; Package Quantity: 5000; PackageDescription: 2-Pin Surface Mount Device, Body 2 x 1.25 mm; Mounting Technology: Surface Mount; ComponentLink2URL: http://industrial.panasonic.com/cdbs/www-data/pdf/RDA0000/AOA0000C86.pdf; DatasheetVersion: 04/2015; ComponentLink1URL: http://www.panasonic.com/; Mount: Surface Mount; ComponentLink1Description: Manufacturer URL; RoHSCompliant: true; PackageReference: 0805; Min Operating Temperature: -55 degC; Height: 0.6 mm; ComponentLink2Description: Datasheet; Max Operating Temperature: 155 degC; Length: 2 mm; Packaging: Tape and Reel; REACH SVHC: Yes

## Sheet PSU.SchDoc
size A4
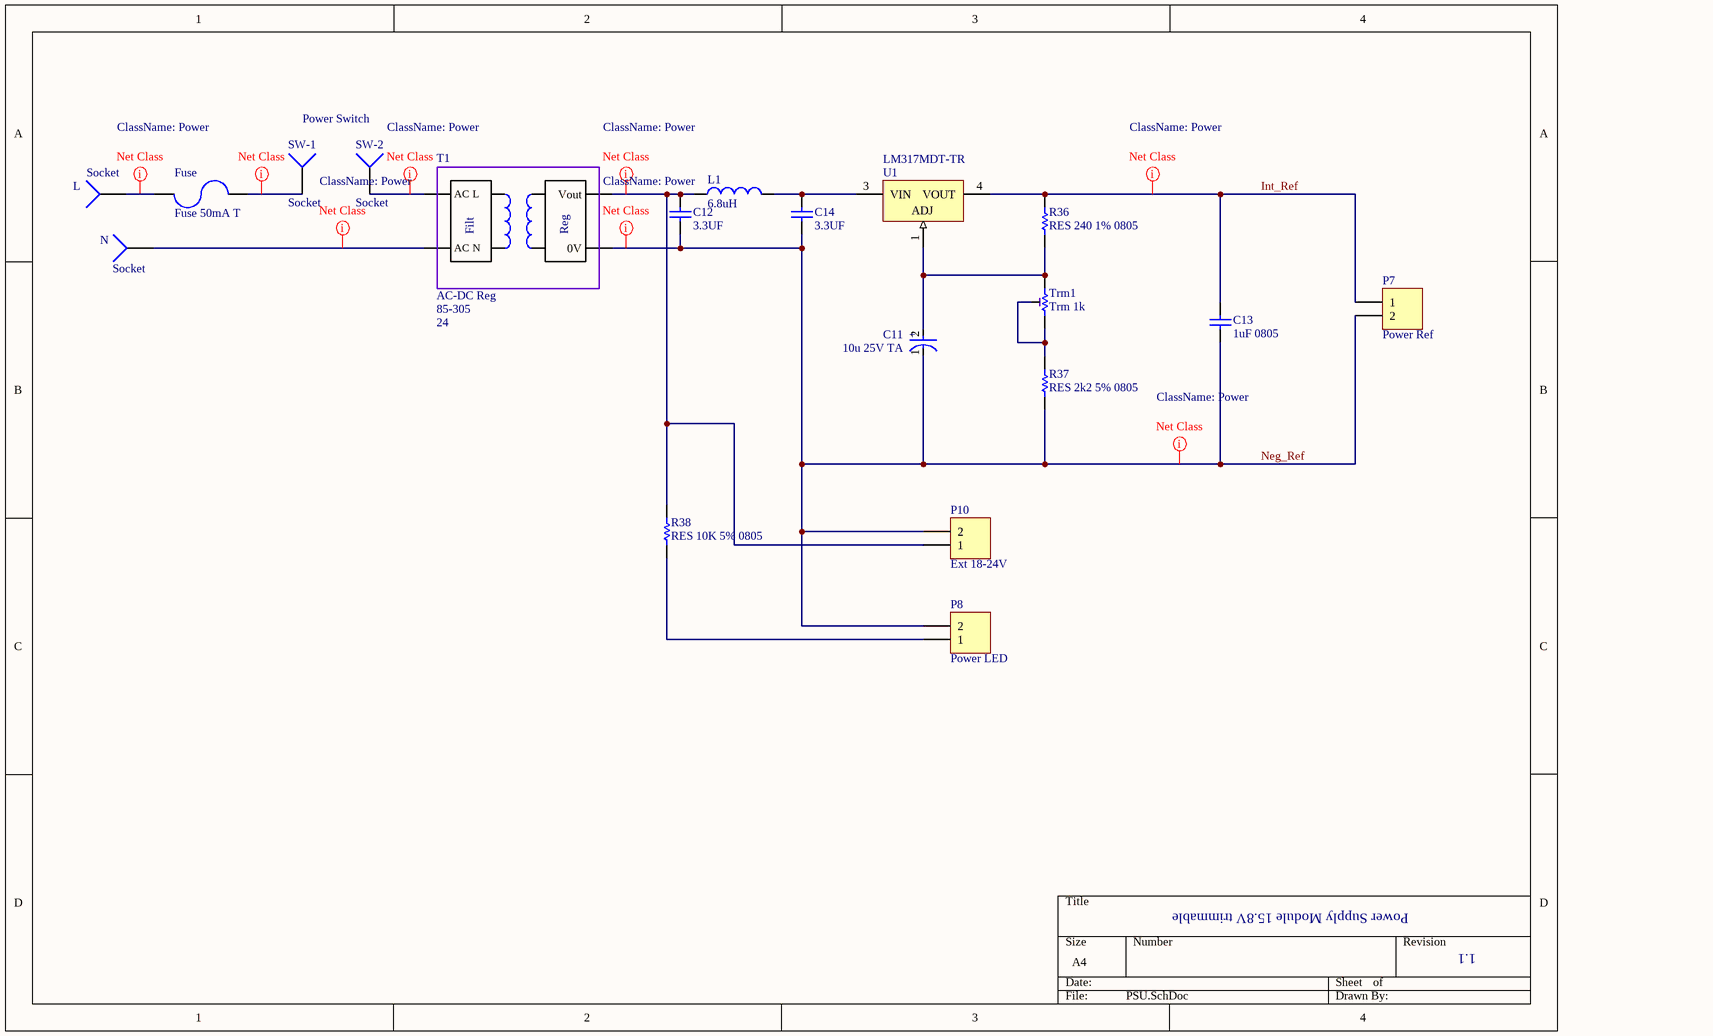
[diagram p2: PSU.SchDoc]

### Parts
C11  10u 25V TA  [FP-TPE-D4-MFG]
C12  3.3UF  [CAPC1206(3216)150_L]
C13  1uF 0805  [CAPC2113X88X50NL30T25]
C14  3.3UF  [CAPC1206(3216)150_L]
Fuse  Fuse 50mA T  [Fuse Holder 20mm PCB with Cover]
L  Socket  [PIN1]
L1  6.8uH  [2.5x2 Inductor]
N  Socket  [PIN1]
P7  Power Ref  [HDR1X2]
P8  Power LED  [HDR1X2]
P10  Ext 18-24V  [HDR1X2]
R36  RES 240 1% 0805  [RESC2013X70X40LL20T20]
R37  RES 2k2 5% 0805  [RESC2013X70X40LL20T20]
R38  RES 10K 5% 0805  [RESC2013X70X40LL20T20]
SW-1  Socket  [PIN1]
SW-2  Socket  [PIN1]
T1  AC-DC Reg  VACin: 85-305  VDC Out: 24  [IRM-02 Moule SM]
Trm1  Trm 1k  [3214W Trimmer]
U1  LM317MDT-TR  [TO-252_L]

### Nets
Int_Ref: C13.1 P7.1 R36.2 U1.4(VOUT)
Neg_Ref: C11.1(C) C12.1 C13.2 C14.1 P7.2 P8.2 P10.2 R37.1 T1.0V
NetC11_2: C11.2(A) R36.1 Trm1.3 U1.1(ADJ)
NetC12_2: C12.2 L1.1 P10.1 R38.2 T1.Vout
NetC14_2: C14.2 L1.2 U1.3(VIN)
NetFuse_1: Fuse.1 L.1
NetFuse_2: Fuse.2 SW-1.1
NetN_1: N.1 T1.N(AC_N)
NetP8_1: P8.1 R38.1
NetR37_2: R37.2 Trm1.1 Trm1.2
NetSW-2_1: SW-2.1 T1.L(AC_L)

### Layout directives
net class Power: Int_Ref, Neg_Ref, NetC12_2, NetFuse_1, NetFuse_2, NetN_1, NetSW-2_1

### Notes on the sheet
- Power Switch
- Power Supply Module 15.8V trimmable
- 1.1
- (in symbol AC-DC Reg Module) Filt; Reg
- (in symbol CMP-05428-000010-1) +

### Library data of the parts
C11 = CMP-05428-000010-1: CAP TANT 10u 25V; Manufacturer Part Number: 6TPE330MAA; Manufacturer: Panasonic Electronic; Tolerance: 20%; Ripple Current: 4400mA; Life: 1000Hours; Leakage Current: 207.9uA; Esr: 10mΩ; Material: Polymer; Dissipation Factor: 10%; Capacitance: 330uF; Temperature Range High: +105°C; Mouser Description: Tantalum Capacitors - Polymer SMD 6.3volts 330uF ESR 10mohm; Device Class L3: Polymer Capacitors; ComponentLink2URL: https://industrial.panasonic.com/cdbs/www-data/pdf/AAA8000/AAA8000C36.pdf; Digikey Description: CAP TANT POLY 330UF 6.3V 2917; Value: 10U; Temperature: -55°C to +105°C; Category: Cap; Voltage Rating: 25v; Package: TPE-D4; Temperature Range Low: -55°C; Footprint Url: https://industrial.panasonic.com/cdbs/www-data/pdf/AAA8000/AAA8000COL85.pdf; Height: 4mm; Octopart: https://octopart.com/6tpe330maa-panasonic-29487875; ComponentLink2Description: Datasheet; Device Class L1: Passive Components; Device Class L2: Capacitors; Lead Free: Yes; RoHS: TRUE; Automotive: No
C12 C14 = CMP-1590-00001-1: as C4 on sheet ChopperAmp; PackageReference: CAPC1206(3216)150
C13 = CMP-2007-00001-1: as C2 on sheet ChopperAmp
Fuse = Fuse
L1 = Inductor: Inductor 6.8uH
P7 P8 P10 = Header 2: Header, 2-Pin; LatestRevisionDate: 17-Jul-2002; LatestRevisionNote: Re-released for DXP Platform.; Publisher: Altium Limited
R36 = CMP-2001-00110-5: Resistor 240 1% 0805  0.2W 10ppm/C; Manufacturer: Panasonic; Voltage Rating: 150 V; Package Quantity: 5000; PackageDescription: 2-Pin Surface Mount Device, Body 2 x 1.25 mm; Mounting Technology: Surface Mount; ComponentLink2URL: http://industrial.panasonic.com/cdbs/www-data/pdf/RDA0000/AOA0000C86.pdf; DatasheetVersion: 04/2015; ComponentLink1URL: http://www.panasonic.com/; Mount: Surface Mount; ComponentLink1Description: Manufacturer URL; RoHSCompliant: true; PackageReference: 0805; Min Operating Temperature: -55 degC; Height: 0.6 mm; ComponentLink2Description: Datasheet; Max Operating Temperature: 155 degC; Length: 2 mm; Packaging: Tape and Reel; REACH SVHC: Yes
R37 = CMP-2001-00110-5: Resistor 2k2 5% 0805  0.2W 10ppm/C; Manufacturer: Panasonic; Voltage Rating: 150 V; Package Quantity: 5000; PackageDescription: 2-Pin Surface Mount Device, Body 2 x 1.25 mm; Mounting Technology: Surface Mount; ComponentLink2URL: http://industrial.panasonic.com/cdbs/www-data/pdf/RDA0000/AOA0000C86.pdf; DatasheetVersion: 04/2015; ComponentLink1URL: http://www.panasonic.com/; Mount: Surface Mount; ComponentLink1Description: Manufacturer URL; RoHSCompliant: true; PackageReference: 0805; Min Operating Temperature: -55 degC; Height: 0.6 mm; ComponentLink2Description: Datasheet; Max Operating Temperature: 155 degC; Length: 2 mm; Packaging: Tape and Reel; REACH SVHC: Yes
R38 = CMP-2001-00110-5: Resistor 10K 5% 0805  0.2W 50ppm/C; Manufacturer: Panasonic; Voltage Rating: 50V; Package Quantity: 5000; PackageDescription: 2-Pin Surface Mount Device, Body 2 x 1.25 mm; Mounting Technology: Surface Mount; ComponentLink2URL: http://industrial.panasonic.com/cdbs/www-data/pdf/RDA0000/AOA0000C86.pdf; DatasheetVersion: 04/2015; ComponentLink1URL: http://www.panasonic.com/; Mount: Surface Mount; ComponentLink1Description: Manufacturer URL; RoHSCompliant: true; PackageReference: 0805; Min Operating Temperature: -55 degC; Height: 0.6 mm; ComponentLink2Description: Datasheet; Max Operating Temperature: 155 degC; Length: 2 mm; Packaging: Tape and Reel; REACH SVHC: Yes
T1 = AC-DC Reg Module: AC-DC Regulated Module 24V; pin to pad: 0V>13 L>1 N>24 Vout>12; Model: *; Make: *
Trm1 = Trimmer
U1 = CMP-0244-00074-1: 500mA, Medium Current 1.2 to 37 V Adjustable Voltage Regulator, 3-Pin DPAK, Tape and Reel; DatasheetVersion: 1/02/2008; ComponentLink1Description: Manufacturer URL; PackageReference: TO-252; ComponentLink2Description: Datasheet; PackageDescription: 3-Pin Transistor Outline Package 2.28 mm Pitch, 9.7 mm Lead Span (DPAK); ComponentLink2URL: http://www.st.com/internet/com/TECHNICAL_RESOURCES/TECHNICAL_LITERATURE/DATASHEET/CD00000549.pdf; PackageVersion: 2011; ComponentLink1URL: http://www.st.com
L N SW-1 SW-2 = Socket: LatestRevisionDate: 17-Jul-2002; LatestRevisionNote: Re-released for DXP Platform.; Publisher: Altium Limited

## Nets that join several sheets
GND: VoltageRef (9 pins), ChopperAmp (10 pins)
Chop_In: VoltageRef (IBC1.3 IBC2.3 SW3.2 SW3.5), ChopperAmp (A1R3.1)
Int_Ref: VoltageRef (P6.1 SW2.1 SW2.6), PSU (C13.1 P7.1 R36.2 U1.4)
Neg_Ref: VoltageRef (P6.2 SW2.3 SW2.4), PSU (9 pins)